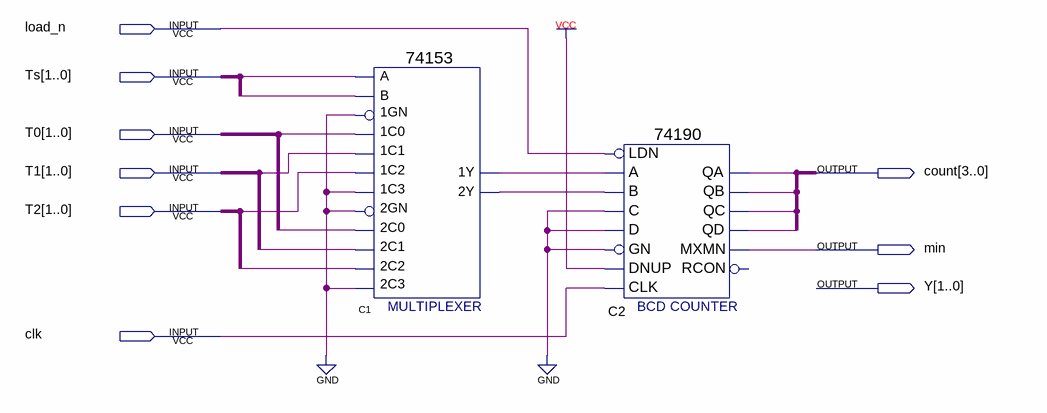
[diagram p0: schematic sheet]
// Quartus schematic fluxo_dados.bdf as structural Verilog: 2 symbols, 9 pins
module fluxo_dados (
  input  load_n,
  input  [1:0] Ts,
  input  [1:0] T0,
  input  [1:0] T1,
  input  [1:0] T2,
  input  clk,
  output [3:0] count,
  output min,
  output [1:0] Y
);

  \74153  C1 (
    .\1C1 (T1[0]), .\1GN (1'b0), .\1C0 (T0[0]), .\2C0 (T0[1]), .\2GN (1'b0), .\2C2 (T2[1]), .\1C2 (T2[0]),
    .\1C3 (1'b0), .B(Ts[1]), .A(Ts[0]), .\2C1 (T1[1]), .\2C3 (1'b0), .\1Y (Y[0]), .\2Y (Y[1]));
  \74190  C2 (
    .LDN(load_n), .A(Y[0]), .C(1'b0), .B(Y[1]), .D(1'b0), .GN(1'b0), .CLK(clk), .DNUP(1'b1), .QA(count[0]),
    .QB(count[1]), .QD(count[3]), .QC(count[2]), .MXMN(min));  // open: RCON
endmodule
